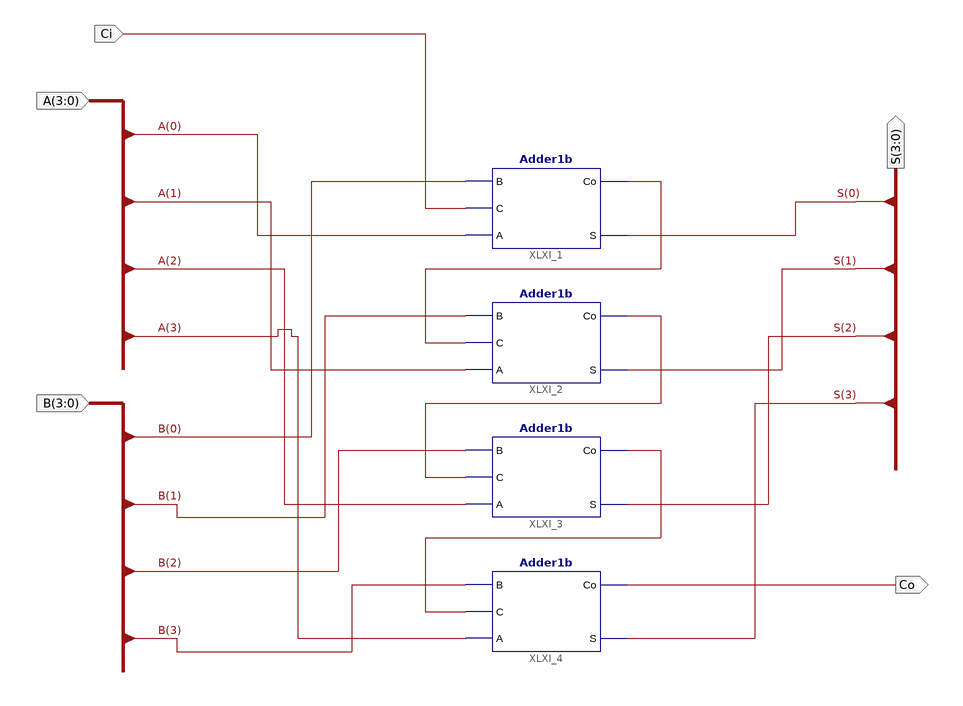
[diagram p0: schematic sheet 1]
// Xilinx ISE schematic Adder4b.sch (kintex7) as structural Verilog: 4 symbols, 5 ports
module Adder4b (
  input  Ci,
  input  [3:0] A,
  input  [3:0] B,
  output Co,
  output [3:0] S
);

  wire XLXN_4, XLXN_5, XLXN_6;

  Adder1b XLXI_1 (.B(B[0]), .C(Ci), .A(A[0]), .Co(XLXN_4), .S(S[0]));
  Adder1b XLXI_2 (.B(B[1]), .C(XLXN_4), .A(A[1]), .Co(XLXN_5), .S(S[1]));
  Adder1b XLXI_3 (.B(B[2]), .C(XLXN_5), .A(A[2]), .Co(XLXN_6), .S(S[2]));
  Adder1b XLXI_4 (.B(B[3]), .C(XLXN_6), .A(A[3]), .Co(Co), .S(S[3]));
endmodule
